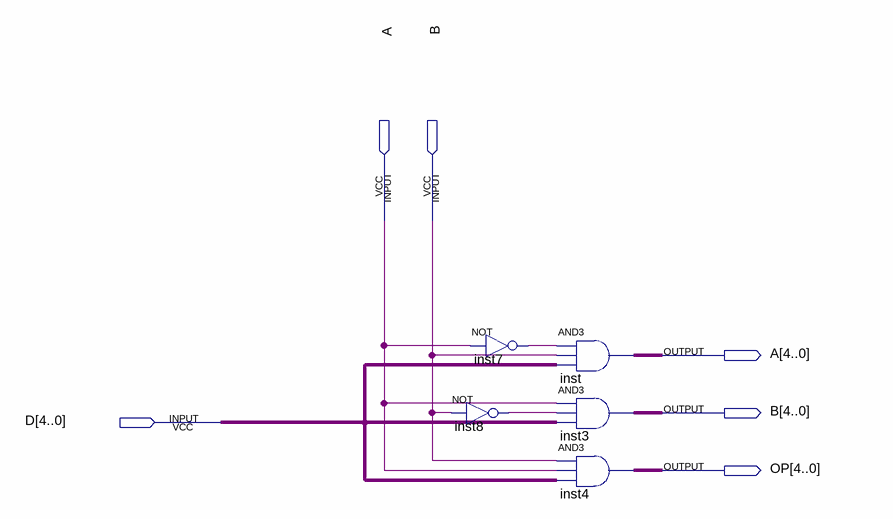
[diagram p0: schematic sheet]
// Quartus schematic Demux.bdf as structural Verilog: 5 symbols, 6 pins
module Demux (
  input  A_1bit,
  input  B_1bit,
  input  [4:0] D,
  output [4:0] A,
  output [4:0] B,
  output [4:0] OP
);

  wire inst7_out, inst8_out;

  not inst7 (inst7_out, A_1bit);
  not inst8 (inst8_out, B_1bit);
  assign A = {5{inst7_out}} & {5{B_1bit}} & D;  // AND3 inst, 5 bits wide
  assign B = {5{A_1bit}} & {5{inst8_out}} & D;  // AND3 inst3, 5 bits wide
  assign OP = {5{B_1bit}} & {5{A_1bit}} & D;  // AND3 inst4, 5 bits wide
endmodule
